# EAGLE design Argo2_Receiver (EAGLE 7.5.0)
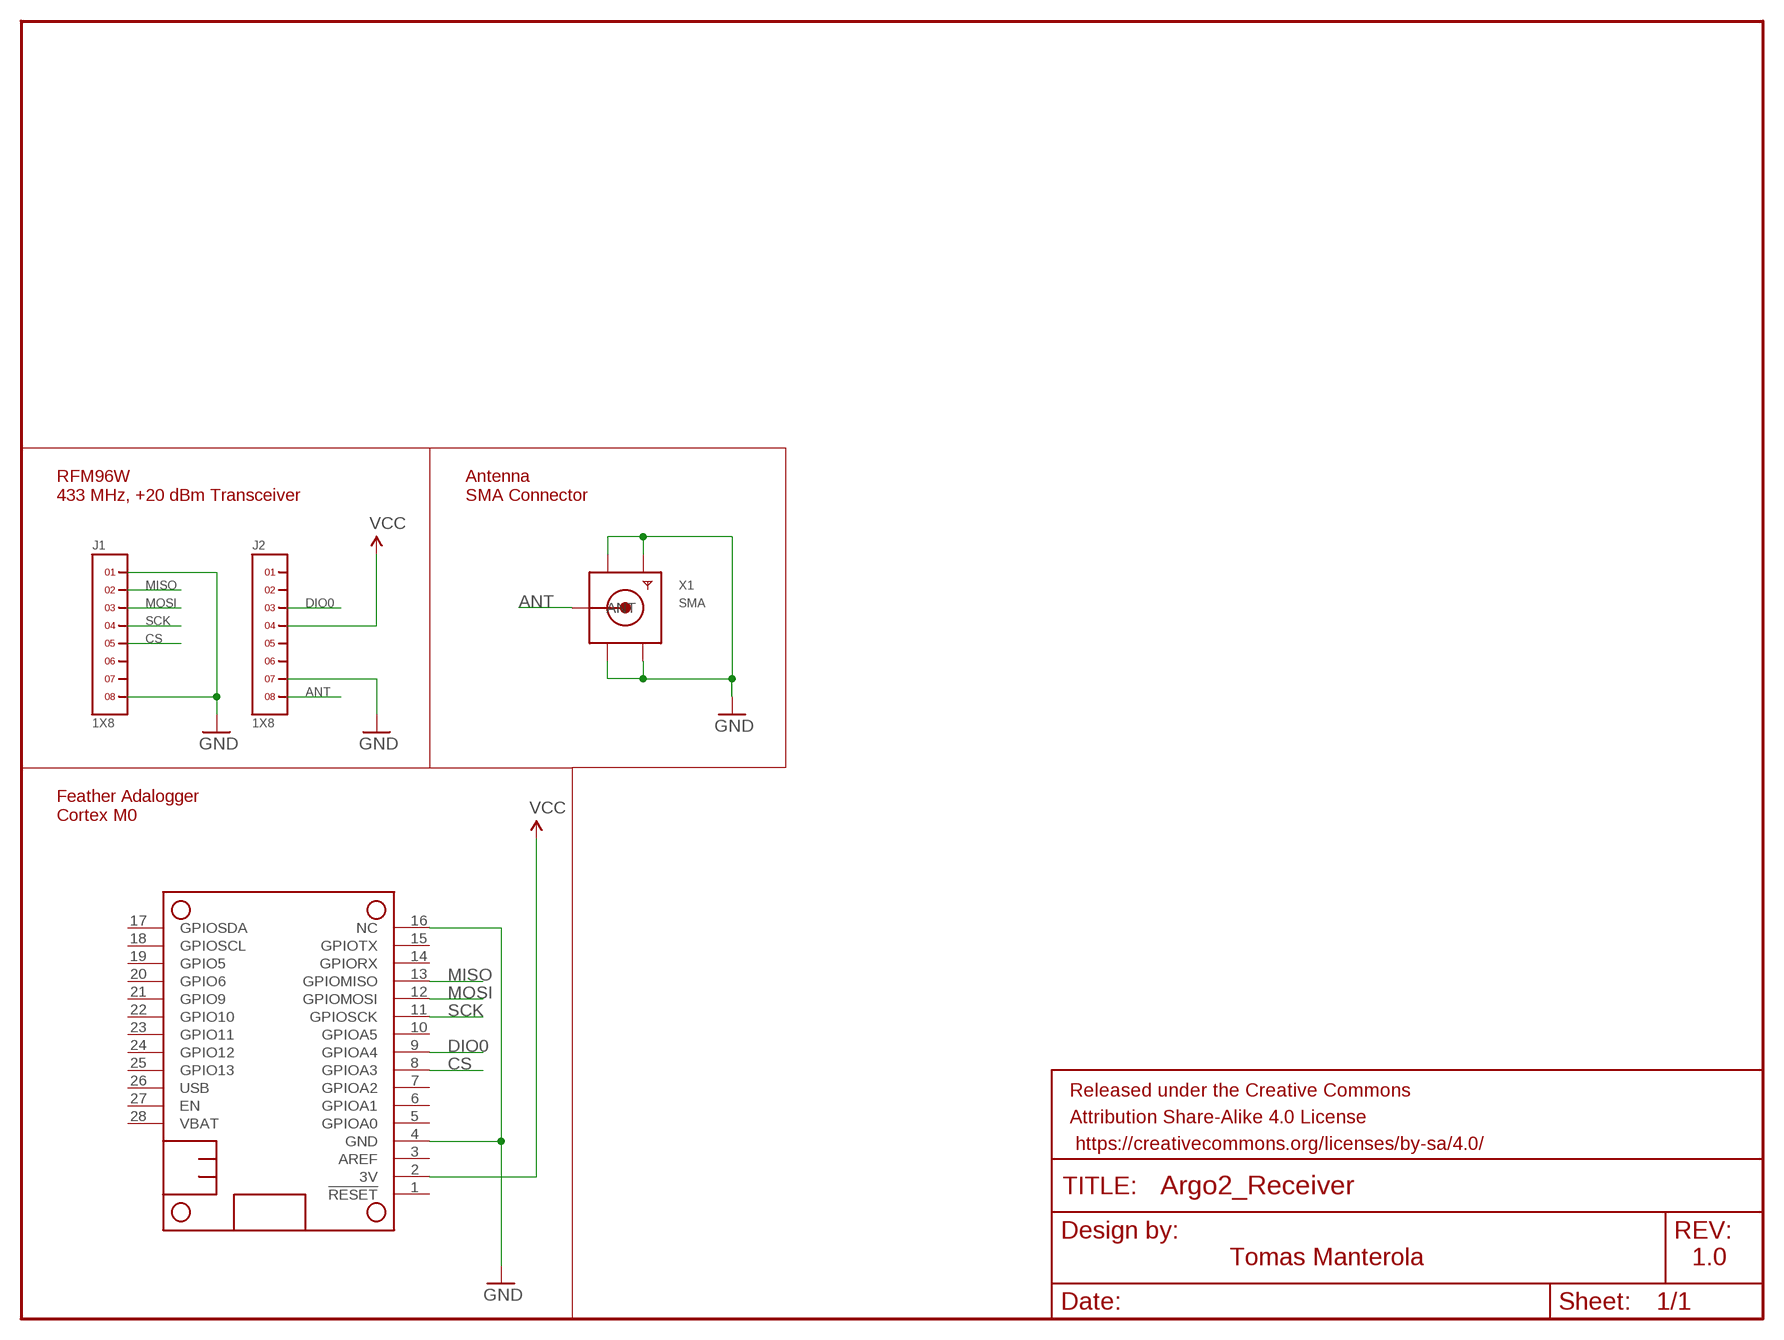
[diagram p0: schematic, sheet 1]

## Parts
FRAME1  FRAME-LETTERNO_PACKAGE  [DUMMY]
J1  1X8  [1X8]
J2  1X8  [1X8]
MS1  FEATHERWING_NODIM  [FEATHERWING_DIM]
X1  SMA  SMACONNECTOR_EDGE  [SMA_EDGELAUNCH]

## Nets
ANT: J2.8 X1.P(ANT)
CS: J1.5 MS1.8(GPIOA3)
DIO0: J2.3 MS1.9(GPIOA4)
GND: J1.1 J1.8 J2.7 MS1.4(GND) MS1.16(NC) X1.GND@1(GND4) X1.GND@2(GND3) X1.GND@3(GND2) X1.GND@4(GND1)
MISO: J1.2 MS1.13(GPIOMISO)
MOSI: J1.3 MS1.12(GPIOMOSI)
SCK: J1.4 MS1.11(GPIOSCK)
VCC: J2.4 MS1.2(3V)
Unconnected: J1.6 J1.7 J2.1 J2.2 J2.5 J2.6 MS1.1(!RESET) MS1.3(AREF) MS1.5(GPIOA0) MS1.6(GPIOA1) MS1.7(GPIOA2) MS1.10(GPIOA5) MS1.14(GPIORX) MS1.15(GPIOTX) MS1.17(GPIOSDA) MS1.18(GPIOSCL) MS1.19(GPIO5) MS1.20(GPIO6) MS1.21(GPIO9) MS1.22(GPIO10) MS1.23(GPIO11) MS1.24(GPIO12) MS1.25(GPIO13) MS1.26(USB) MS1.27(EN) MS1.28(VBAT)

## Notes on the sheet
- RFM96W
  433 MHz, +20 dBm Transceiver
- Antenna
  SMA Connector
- Feather Adalogger
  Cortex M0
- Tomas Manterola | 1.0

## Library data of the parts
FRAME1 = SparkFun-Aesthetics:FRAME-LETTER: Schematic Frame Standard 8.5x11 US Letter frame; DESIGNER: Tomas Manterola; VERSION: 1.0
J1 J2 = headers(2mm):1X8
MS1 = adafruit:FEATHERWING
X1 = adafruit:SMACONNECTOR: SMA Connector 90° DIP SMA Connector, 50 Ohm (4UConnector: 07259)

## Net classes
1 fiftyohm: width 1 mm

## Board
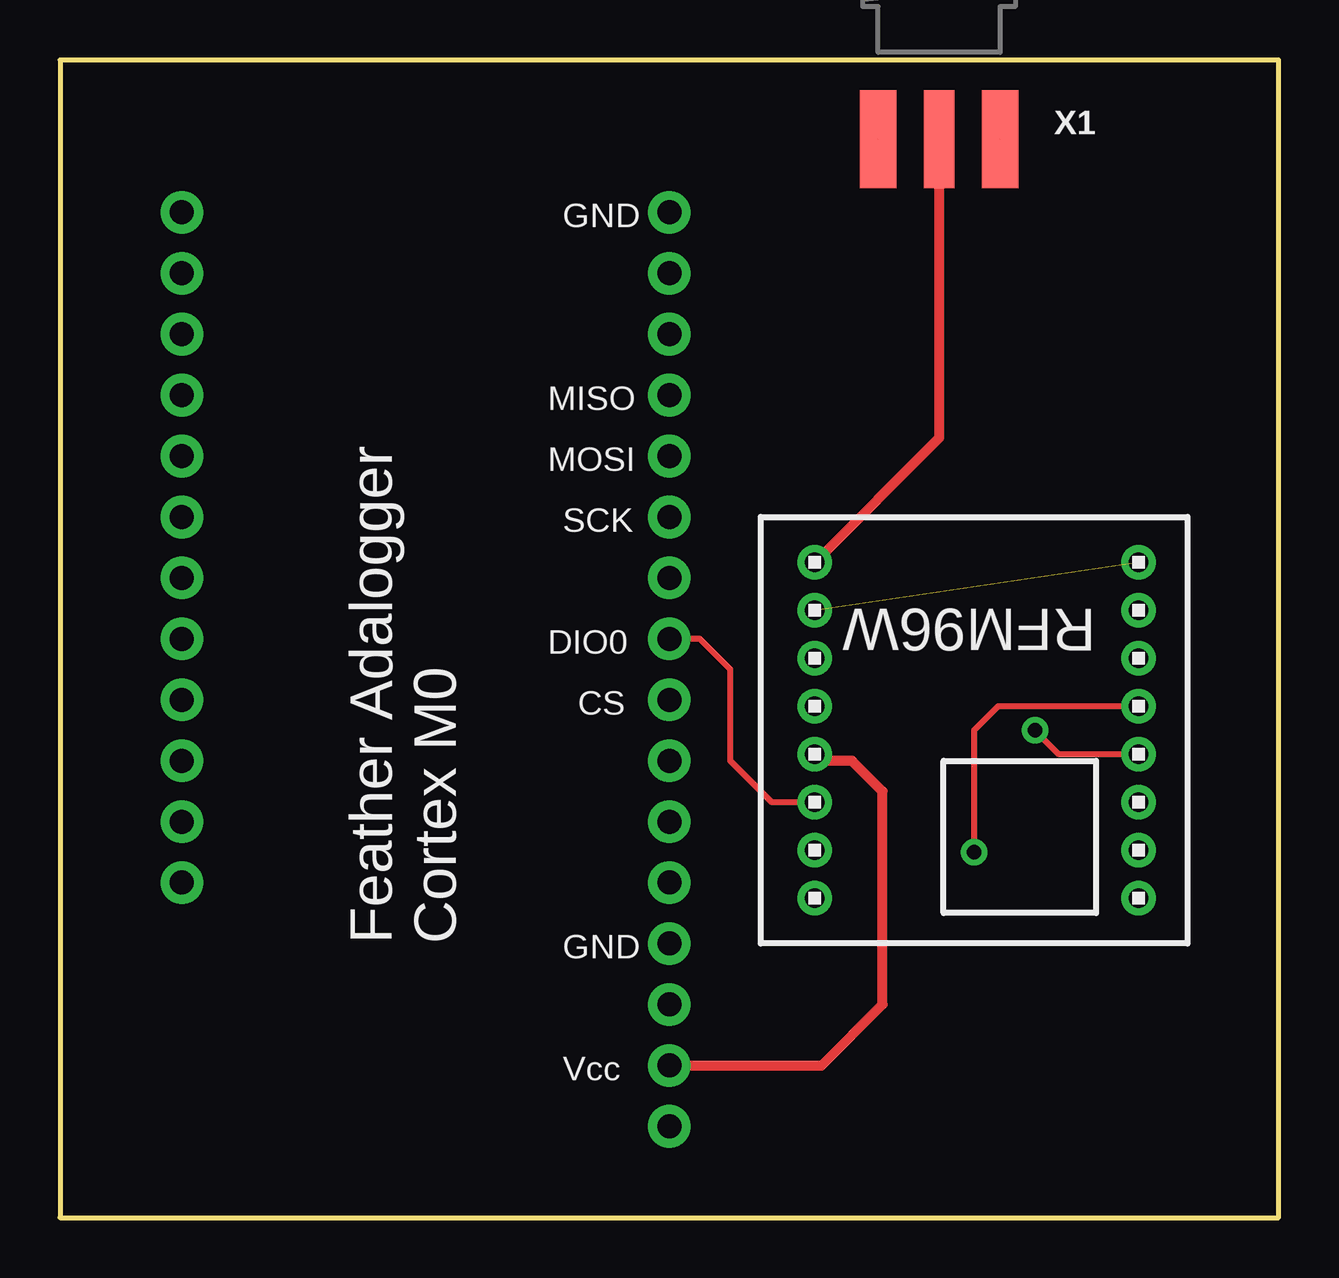
[diagram p1: board, top side]
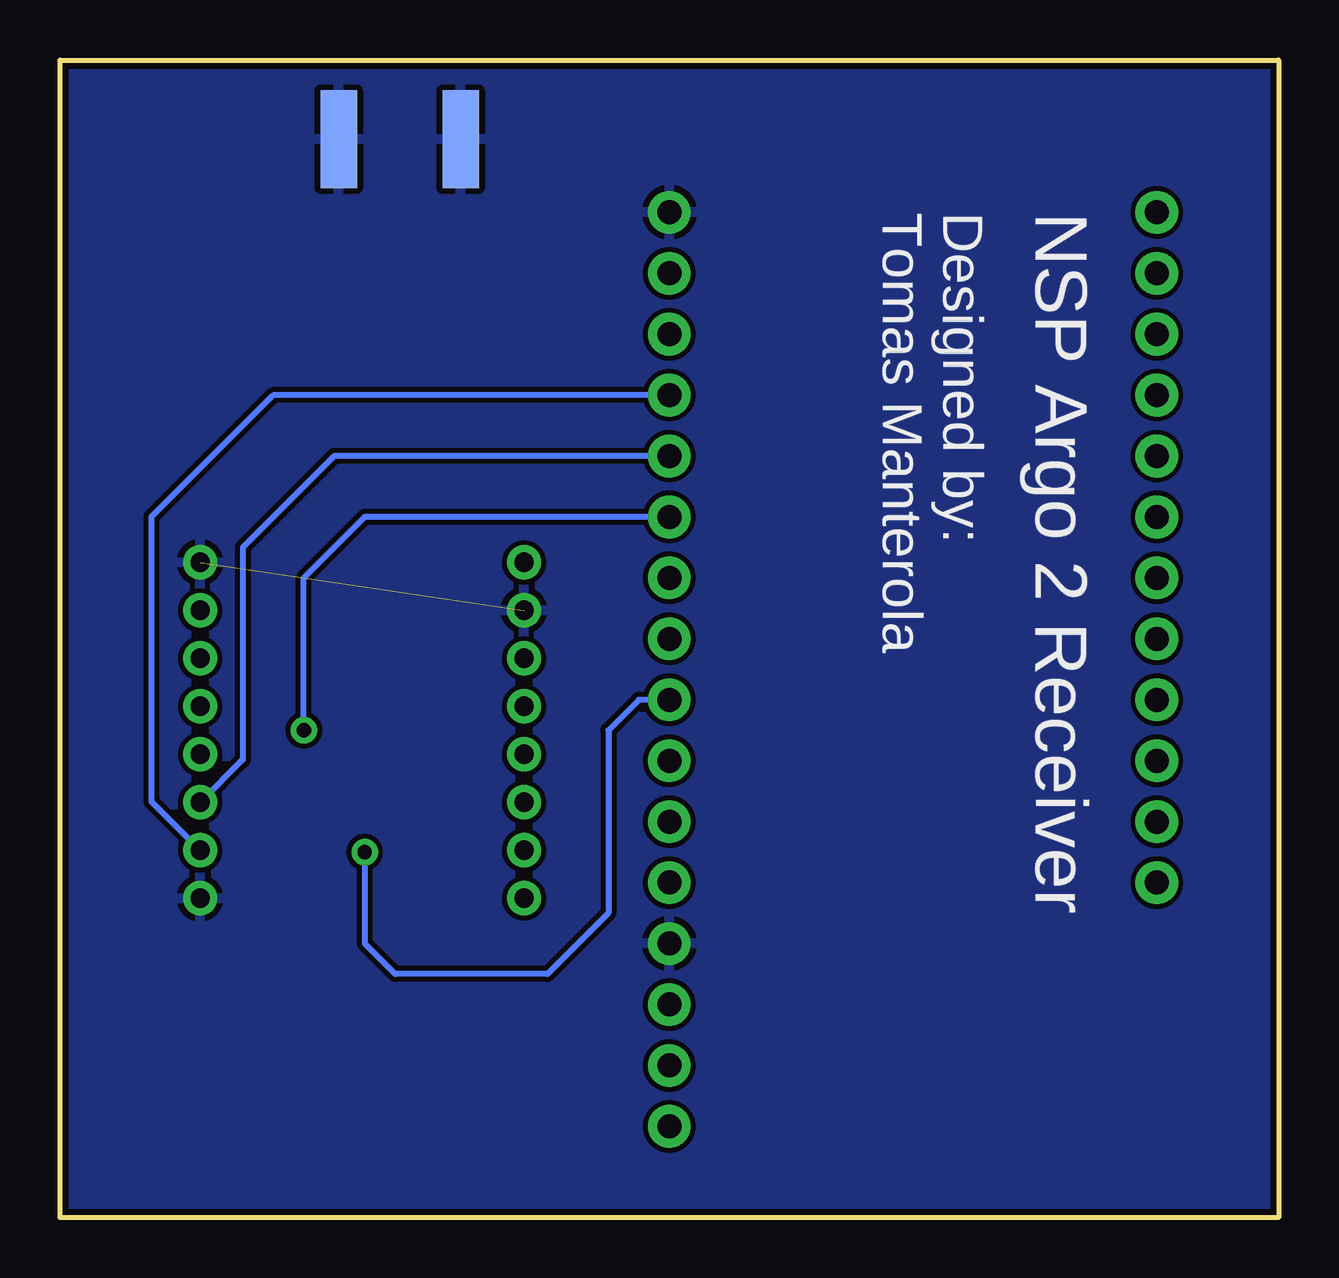
[diagram p2: board, bottom side, seen from below]

Size 50.8 x 48.26 mm. Coordinates in mm from the lower left corner, seen from the top.
Outline: 0,0 50.8,0 50.8,48.26 0,48.26 0,0
Copper layers (1*16): Top 0.035mm / dielectric 1.5mm / Bottom 0.035mm
Design rules "SparkFun": minimum track width 8mil, minimum drill 20mil, track to track 8mil, track to pad 8mil, pad to pad 8mil, via to via 8mil, smd to smd 8mil, copper to edge 10mil, drill to drill 8mil, minimum pad ring 12mil, minimum via ring 10mil, stop-mask expansion 4mil, vias tented up to drill 25mil, thermal gap 10mil

### Footprints (pad centres in the part's own frame; a part is rotated, then mirrored left to right if it is on the bottom)
1X8 = drill 0.8 pad 1.422: 1 -7,0; 2 -5,0; 3 -3,0; 4 -1,0; 5 1,0; 6 3,0; 7 5,0; 8 7,0
FEATHERWING_DIM = drill 1 pad 1.778: 1 6.35,1.27; 2 8.89,1.27; 3 11.43,1.27; 4 13.97,1.27; 5 16.51,1.27; 6 19.05,1.27; 7 21.59,1.27; 8 24.13,1.27; 9 26.67,1.27; 10 29.21,1.27; 11 31.75,1.27; 12 34.29,1.27; 13 36.83,1.27; 14 39.37,1.27; 15 41.91,1.27; 16 44.45,1.27; 17 44.45,21.59; 18 41.91,21.59; 19 39.37,21.59; 20 36.83,21.59; 21 34.29,21.59; 22 31.75,21.59; 23 29.21,21.59; 24 26.67,21.59; 25 24.13,21.59; 26 21.59,21.59; 27 19.05,21.59; 28 16.51,21.59
SMA_EDGELAUNCH = smd 4.064 x 1.524: GND@1 2.032,-2.54; GND@2 2.032,2.54 | smd 4.064 x 1.524 bottom: GND@3 2.032,2.54; GND@4 2.032,-2.54 | smd 4.064 x 1.27: P 2.032,0

### Placement (x,y rotation side)
FRAME1  -55.88,34.29 0 top  (outside the outline)
J1  44.96,20.32 90 top
J2  31.46,20.32 90 top
MS1  26.67,-2.54 90 top
X1  36.64,46.99 270 top

### Tracks (layer width: path | path; a pad name or v marks a point on that pad's centre or on a via)
ANT
  Top 0.406: X1.P 36.64,32.5 J2.8
CS  (via drill 0.6)
  Top 0.254: J1.5 39.1,21.32 38.1,20.32 v38.1,15.24
  Bottom 0.254: MS1.8 26.67,21.59 27.94,20.32 27.94,12.7 30.48,10.16 36.83,10.16 38.1,11.43 v38.1,15.24
DIO0
  Top 0.254: J2.3 29.67,17.32 27.94,19.05 27.94,22.86 26.67,24.13 MS1.9
GND  (3 unrouted)
  pour Bottom: 0,0 0,48.26 50.8,48.26 50.8,0
MISO
  Bottom 0.254: MS1.13 41.91,34.29 46.99,29.21 46.99,17.35 J1.2
MOSI
  Bottom 0.254: MS1.12 39.37,31.75 43.18,27.94 43.18,19.1 J1.3
SCK  (via drill 0.6)
  Top 0.254: J1.4 41.64,19.32 v40.64,20.32
  Bottom 0.254: MS1.11 38.1,29.21 40.64,26.67 v40.64,20.32
VCC
  Top 0.406: MS1.2 31.75,6.35 34.29,8.89 34.29,17.78 33.02,19.05 31.73,19.05 J2.4

### Text on the board
tPlace: GND | MISO | MOSI | SCK | RFM96W | DIO0 | CS | Feather Adalogger / Cortex M0 | GND | Vcc
bPlace: NSP Argo 2 Receiver | Designed by: / Tomas Manterola